# EasyEDA schematic Schlage Skeleton Key.json

## Sheets
1 schematic_dev: TITLE: Schlage Skeleton Key; REV: 1.0; Date: 2024-02-15; Sheet: 1/1; Company: Renegade Labs
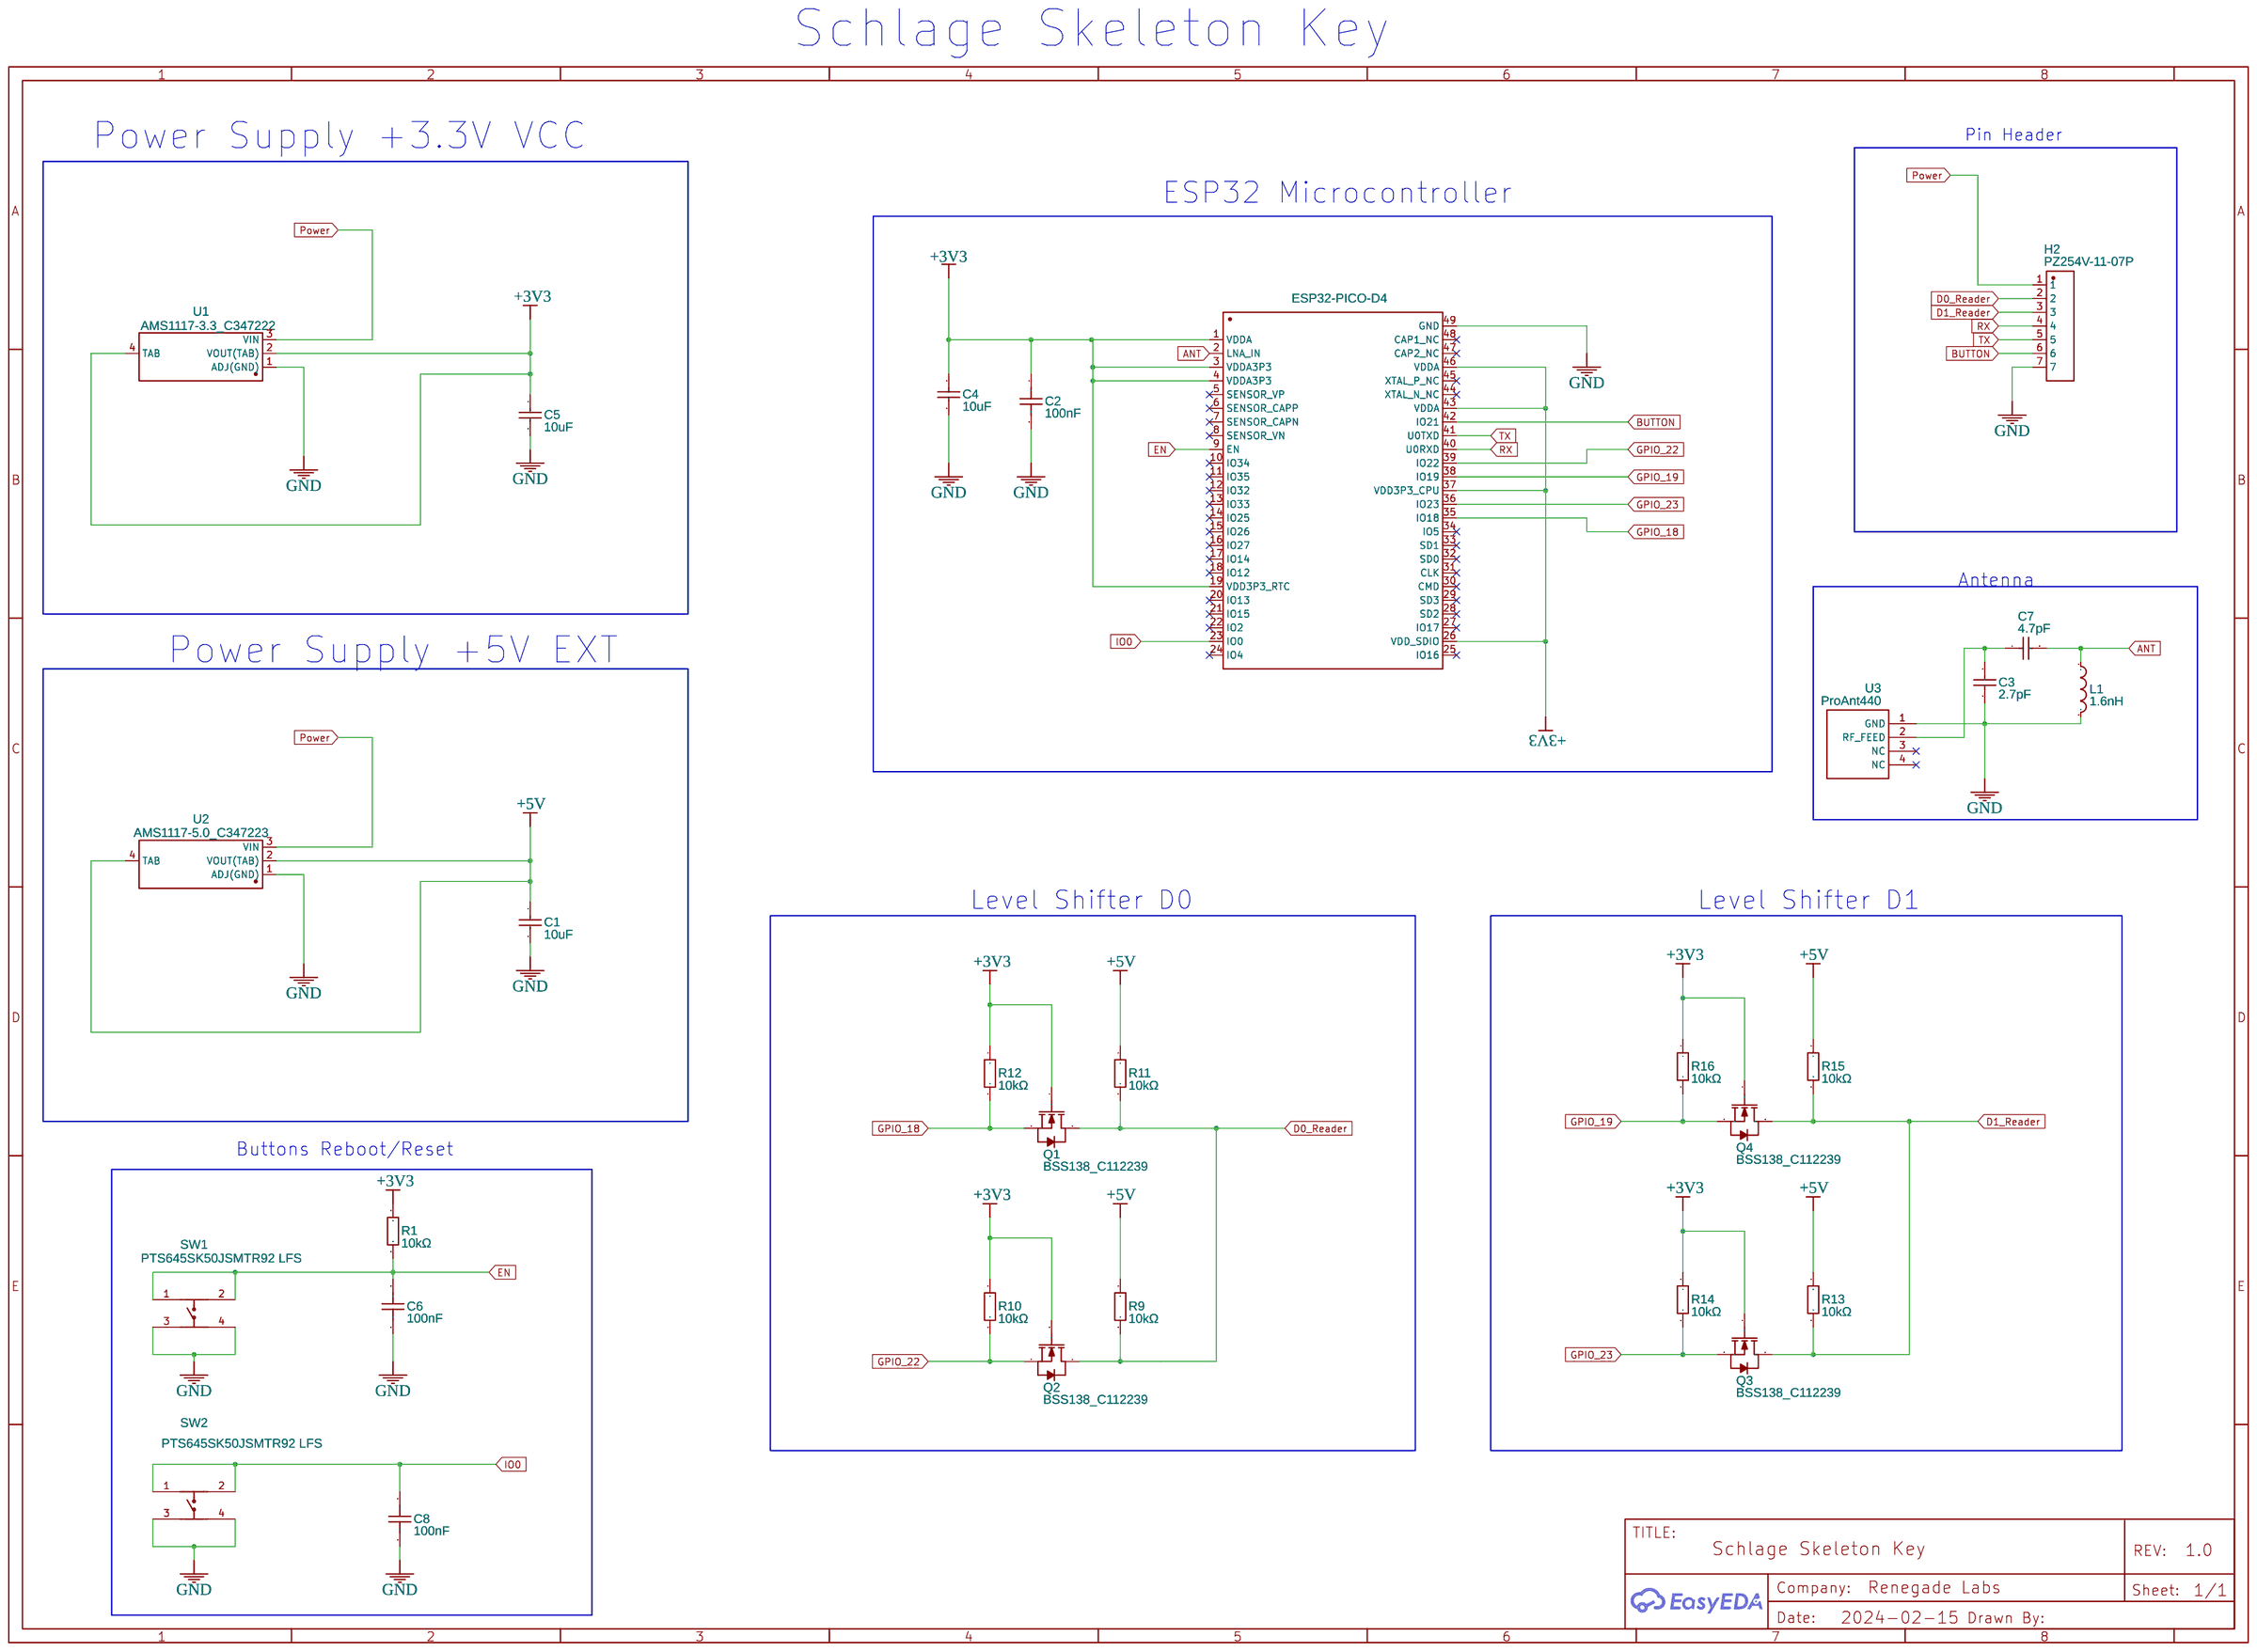
[diagram p0: schematic_dev]
2 schematic
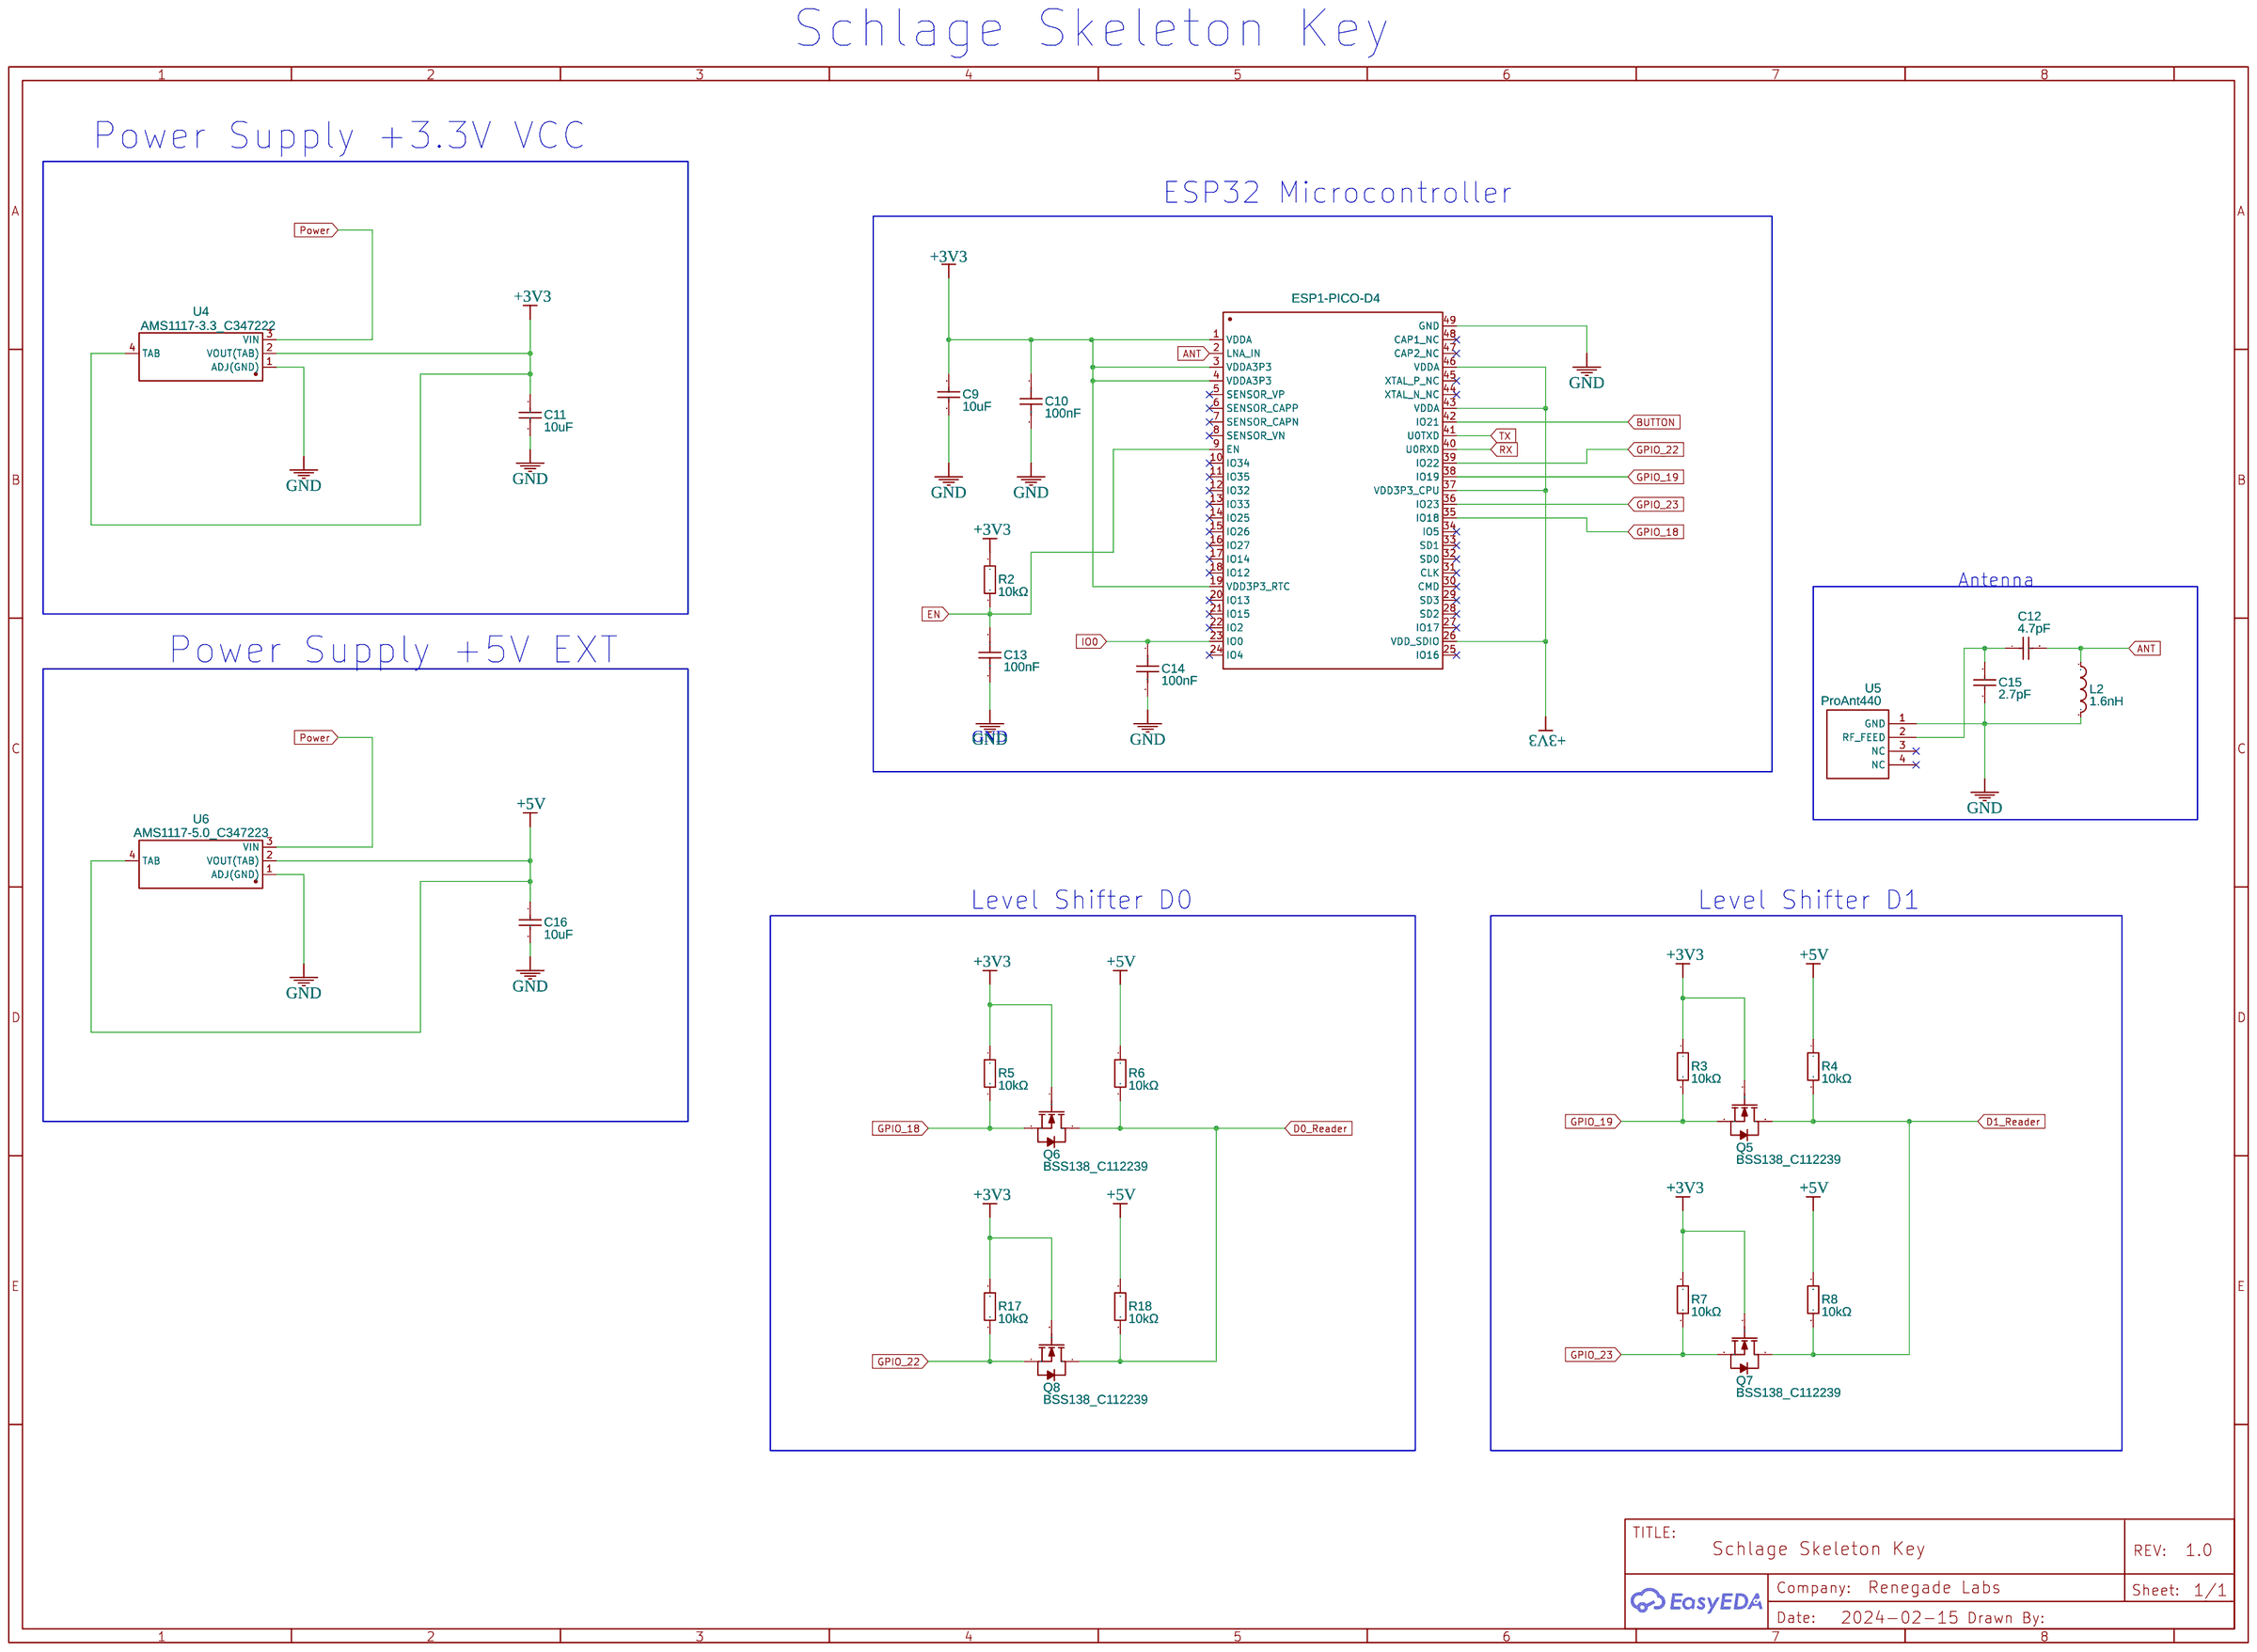
[diagram p1: schematic]

## Parts
sheet schematic
C9  10uF  [C0805]
C10  100nF  [C0603]
C11  10uF  [C0805]
C12  4.7pF  [C0402]
C13  100nF  [C0603]
C14  100nF  [C0603]
C15  2.7pF  [C0402]
C16  10uF  [C0805]
ESP1-PICO-D4  -  [LGA-48_L7.0-W7.0-P0.50-BL-EP5.4]
L2  1.6nH  [L0402]
Q5  BSS138_C112239  [SOT-23-3_L2.9-W1.6-P1.90-LS2.8-BR]
Q6  BSS138_C112239  [SOT-23-3_L2.9-W1.6-P1.90-LS2.8-BR]
Q7  BSS138_C112239  [SOT-23-3_L2.9-W1.6-P1.90-LS2.8-BR]
Q8  BSS138_C112239  [SOT-23-3_L2.9-W1.6-P1.90-LS2.8-BR]
R2  10kΩ  [R0402]
R3  10kΩ  [R0402]
R4  10kΩ  [R0402]
R5  10kΩ  [R0402]
R6  10kΩ  [R0402]
R7  10kΩ  [R0402]
R8  10kΩ  [R0402]
R17  10kΩ  [R0402]
R18  10kΩ  [R0402]
U4  AMS1117-3.3_C347222  [SOT-223-4_L6.5-W3.5-P2.30-LS7.0-BR]
U5  ProAnt440  [PROANT440]
U6  AMS1117-5.0_C347223  [SOT-223_L6.7-W3.5-P2.30-BR]
sheet schematic_dev
C1  10uF  [C0805]
C2  100nF  [C0603]
C3  2.7pF  [C0402]
C4  10uF  [C0805]
C5  10uF  [C0805]
C6  100nF  [C0603]
C7  4.7pF  [C0402]
C8  100nF  [C0603]
ESP32-PICO-D4  -  [LGA-48_L7.0-W7.0-P0.50-BL-EP5.4]
H2  PZ254V-11-07P  [HDR-TH_7P-P2.54-V-M]
L1  1.6nH  [L0402]
Q1  BSS138_C112239  [SOT-23-3_L2.9-W1.6-P1.90-LS2.8-BR]
Q2  BSS138_C112239  [SOT-23-3_L2.9-W1.6-P1.90-LS2.8-BR]
Q3  BSS138_C112239  [SOT-23-3_L2.9-W1.6-P1.90-LS2.8-BR]
Q4  BSS138_C112239  [SOT-23-3_L2.9-W1.6-P1.90-LS2.8-BR]
R1  10kΩ  [R0402]
R9  10kΩ  [R0402]
R10  10kΩ  [R0402]
R11  10kΩ  [R0402]
R12  10kΩ  [R0402]
R13  10kΩ  [R0402]
R14  10kΩ  [R0402]
R15  10kΩ  [R0402]
R16  10kΩ  [R0402]
SW1  PTS645SK50JSMTR92 LFS  [KEY-SMD_4P-L6.0-W6.0-P4.50-LS6.6]
SW2  PTS645SK50JSMTR92 LFS  [KEY-SMD_4P-L6.0-W6.0-P4.50-LS6.6]
U1  AMS1117-3.3_C347222  [SOT-223-4_L6.5-W3.5-P2.30-LS7.0-BR]
U2  AMS1117-5.0_C347223  [SOT-223_L6.7-W3.5-P2.30-BR]
U3  ProAnt440  [PROANT440]

## Library data of the parts
C1 C4 C5 C9 C11 C16 = CL21A106KOQNNNE: Supplier: LCSC; Manufacturer: SAMSUNG(三星); Supplier Part: C1713; JLCPCB Part Class: Extended Part
C2 C6 C8 C10 C13 C14 = CL10B104KB8NNNC: Supplier: LCSC; Manufacturer: SAMSUNG(三星); Supplier Part: C1591; JLCPCB Part Class: Extended Part
C7 C12 = 0402CG4R7C500NT: Supplier: LCSC; Manufacturer: FH(风华); Supplier Part: C1569; JLCPCB Part Class: Extended Part
C3 C15 = 0402CG2R7C500NT: Supplier: LCSC; Manufacturer: FH(风华); Supplier Part: C1561; JLCPCB Part Class: Extended Part
ESP1-PICO-D4 ESP32-PICO-D4 = ESP32-PICO-D4: Contributor: LCSC; Supplier: LCSC; Supplier Part: C193707; Manufacturer: ESPRESSIF(乐鑫); JLCPCB Part Class: Extended Part
L1 L2 = MLG1005S1N6BT000: Supplier: LCSC; Manufacturer: TDK; Supplier Part: C87529; JLCPCB Part Class: Extended Part
Q1-Q8 = BSS138_C112239: Supplier: LCSC; Manufacturer: SHIKUES(时科); Manufacturer Part: BSS138; Supplier Part: C112239; JLCPCB Part Class: Extended Part
R1-R18 = 0402WGF1002TCE: Supplier: LCSC; Manufacturer: UNI-ROYAL(厚声); Supplier Part: C25744; JLCPCB Part Class: Basic Part
U1 U4 = AMS1117-3.3_C347222: Contributor: LCSC; Supplier: LCSC; Supplier Part: C347222; Manufacturer: UMW(友台半导体); Manufacturer Part: AMS1117-3.3; JLCPCB Part Class: Extended Part
U3 U5 = ProAnt440: Contributor: 李小华
U2 U6 = AMS1117-5.0_C347223: Contributor: LCSC; Supplier: LCSC; Supplier Part: C347223; Manufacturer: UMW(友台半导体); Manufacturer Part: AMS1117-5.0; JLCPCB Part Class: Extended Part
H2 = PZ254V-11-07P: Contributor: LCSC; Supplier: LCSC; Supplier Part: C492406; Manufacturer: XFCN(兴飞); JLCPCB Part Class: Extended Part
SW1 SW2 = PTS645SK50JSMTR92 LFS: Contributor: LCSC; Supplier: LCSC; Supplier Part: C2801823; Manufacturer: C&K; JLCPCB Part Class: Extended Part

## Nets
+3V3: C2.1 C4.1 C5.1 C9.1 C10.1 C11.1 ESP1-PICO-D4.1(VDDA) ESP1-PICO-D4.3(VDDA3P3) ESP1-PICO-D4.4(VDDA3P3) ESP1-PICO-D4.19(VDD3P3_RTC) ESP1-PICO-D4.26(VDD_SDIO) ESP1-PICO-D4.37(VDD3P3_CPU) ESP1-PICO-D4.43(VDDA) ESP1-PICO-D4.46(VDDA) ESP32-PICO-D4.1(VDDA) ESP32-PICO-D4.3(VDDA3P3) ESP32-PICO-D4.4(VDDA3P3) ESP32-PICO-D4.19(VDD3P3_RTC) ESP32-PICO-D4.26(VDD_SDIO) ESP32-PICO-D4.37(VDD3P3_CPU) ESP32-PICO-D4.43(VDDA) ESP32-PICO-D4.46(VDDA) Q1.1(G) Q2.1(G) Q3.1(G) Q4.1(G) Q5.1(G) Q6.1(G) Q7.1(G) Q8.1(G) R1.1 R2.1 R3.1 R5.1 R7.1 R10.1 R12.1 R14.1 R16.1 R17.1 U1.2(VOUT(TAB)) U1.4(TAB) U4.2(VOUT(TAB)) U4.4(TAB)
+5V: C1.1 C16.1 R4.1 R6.1 R8.1 R9.1 R11.1 R13.1 R15.1 R18.1 U2.2(VOUT(TAB)) U2.4(TAB) U6.2(VOUT(TAB)) U6.4(TAB)
GND: C1.2 C2.2 C3.2 C4.2 C5.2 C6.2 C8.2 C9.2 C10.2 C11.2 C13.2 C14.2 C15.2 C16.2 ESP1-PICO-D4.49(GND) ESP32-PICO-D4.49(GND) H2.7 L1.2 L2.2 SW1.3 SW1.4 SW2.3 SW2.4 U1.1(ADJ(GND)) U2.1(ADJ(GND)) U3.1(GND) U4.1(ADJ(GND)) U5.1(GND) U6.1(ADJ(GND))
ANT: C7.2 C12.2 ESP1-PICO-D4.2(LNA_IN) ESP32-PICO-D4.2(LNA_IN) L1.1 L2.1
BUTTON: ESP1-PICO-D4.42(IO21) ESP32-PICO-D4.42(IO21) H2.6
D0_Reader: H2.2 Q1.3(D) Q2.3(D) Q6.3(D) Q8.3(D) R6.2 R9.2 R11.2 R18.2
D1_Reader: H2.3 Q3.3(D) Q4.3(D) Q5.3(D) Q7.3(D) R4.2 R8.2 R13.2 R15.2
EN: C6.1 C13.1 ESP1-PICO-D4.9(EN) ESP32-PICO-D4.9(EN) R1.2 R2.2 SW1.1 SW1.2
GPIO_18: ESP1-PICO-D4.35(IO18) ESP32-PICO-D4.35(IO18) Q1.2(S) Q6.2(S) R5.2 R12.2
GPIO_19: ESP1-PICO-D4.38(IO19) ESP32-PICO-D4.38(IO19) Q4.2(S) Q5.2(S) R3.2 R16.2
GPIO_22: ESP1-PICO-D4.39(IO22) ESP32-PICO-D4.39(IO22) Q2.2(S) Q8.2(S) R10.2 R17.2
GPIO_23: ESP1-PICO-D4.36(IO23) ESP32-PICO-D4.36(IO23) Q3.2(S) Q7.2(S) R7.2 R14.2
IO0: C8.1 C14.1 ESP1-PICO-D4.23(IO0) ESP32-PICO-D4.23(IO0) SW2.1 SW2.2
Power: H2.1 U1.3(VIN) U2.3(VIN) U4.3(VIN) U6.3(VIN)
RX: ESP1-PICO-D4.40(U0RXD) ESP32-PICO-D4.40(U0RXD) H2.4
TX: ESP1-PICO-D4.41(U0TXD) ESP32-PICO-D4.41(U0TXD) H2.5
Net-(C3-1): C3.1 C7.1 U3.2(RF FEED)
Net-(C12-1): C12.1 C15.1 U5.2(RF FEED)

Not connected (* = marked no-connect by the designer): ESP1-PICO-D4 5(SENSOR_VP)* 6(SENSOR_CAPP)* 7(SENSOR_CAPN)* 8(SENSOR_VN)* 10(IO34)* 11(IO35)* 12(IO32)* 13(IO33)* 14(IO25)* 15(IO26)* 16(IO27)* 17(IO14)* 18(IO12)* 20(IO13)* 21(IO15)* 22(IO2)* 24(IO4)* 25(IO16)* 27(IO17)* 28(SD2)* 29(SD3)* 30(CMD)* 31(CLK)* 32(SD0)* 33(SD1)* 34(IO5)* 44(XTAL_N_NC)* 45(XTAL_P_NC)* 47(CAP2_NC)* 48(CAP1_NC)*; ESP32-PICO-D4 5(SENSOR_VP)* 6(SENSOR_CAPP)* 7(SENSOR_CAPN)* 8(SENSOR_VN)* 10(IO34)* 11(IO35)* 12(IO32)* 13(IO33)* 14(IO25)* 15(IO26)* 16(IO27)* 17(IO14)* 18(IO12)* 20(IO13)* 21(IO15)* 22(IO2)* 24(IO4)* 25(IO16)* 27(IO17)* 28(SD2)* 29(SD3)* 30(CMD)* 31(CLK)* 32(SD0)* 33(SD1)* 34(IO5)* 44(XTAL_N_NC)* 45(XTAL_P_NC)* 47(CAP2_NC)* 48(CAP1_NC)*; U3 3(NC)* 4(NC)*; U5 3(NC)* 4(NC)*

## Notes on the sheets
sheet 1
- Schlage Skeleton Key
- Power Supply +3.3V VCC
- Pin Header
- ESP32 Microcontroller
- Antenna
- Power Supply +5V EXT
- Level Shifter D0
- Level Shifter D1
- Buttons Reboot/Reset
sheet 2
- Schlage Skeleton Key
- Power Supply +3.3V VCC
- ESP32 Microcontroller
- Antenna
- Power Supply +5V EXT
- GND
- Level Shifter D0
- Level Shifter D1
